# EAGLE design 00A-004 (EAGLE 9.6.2)
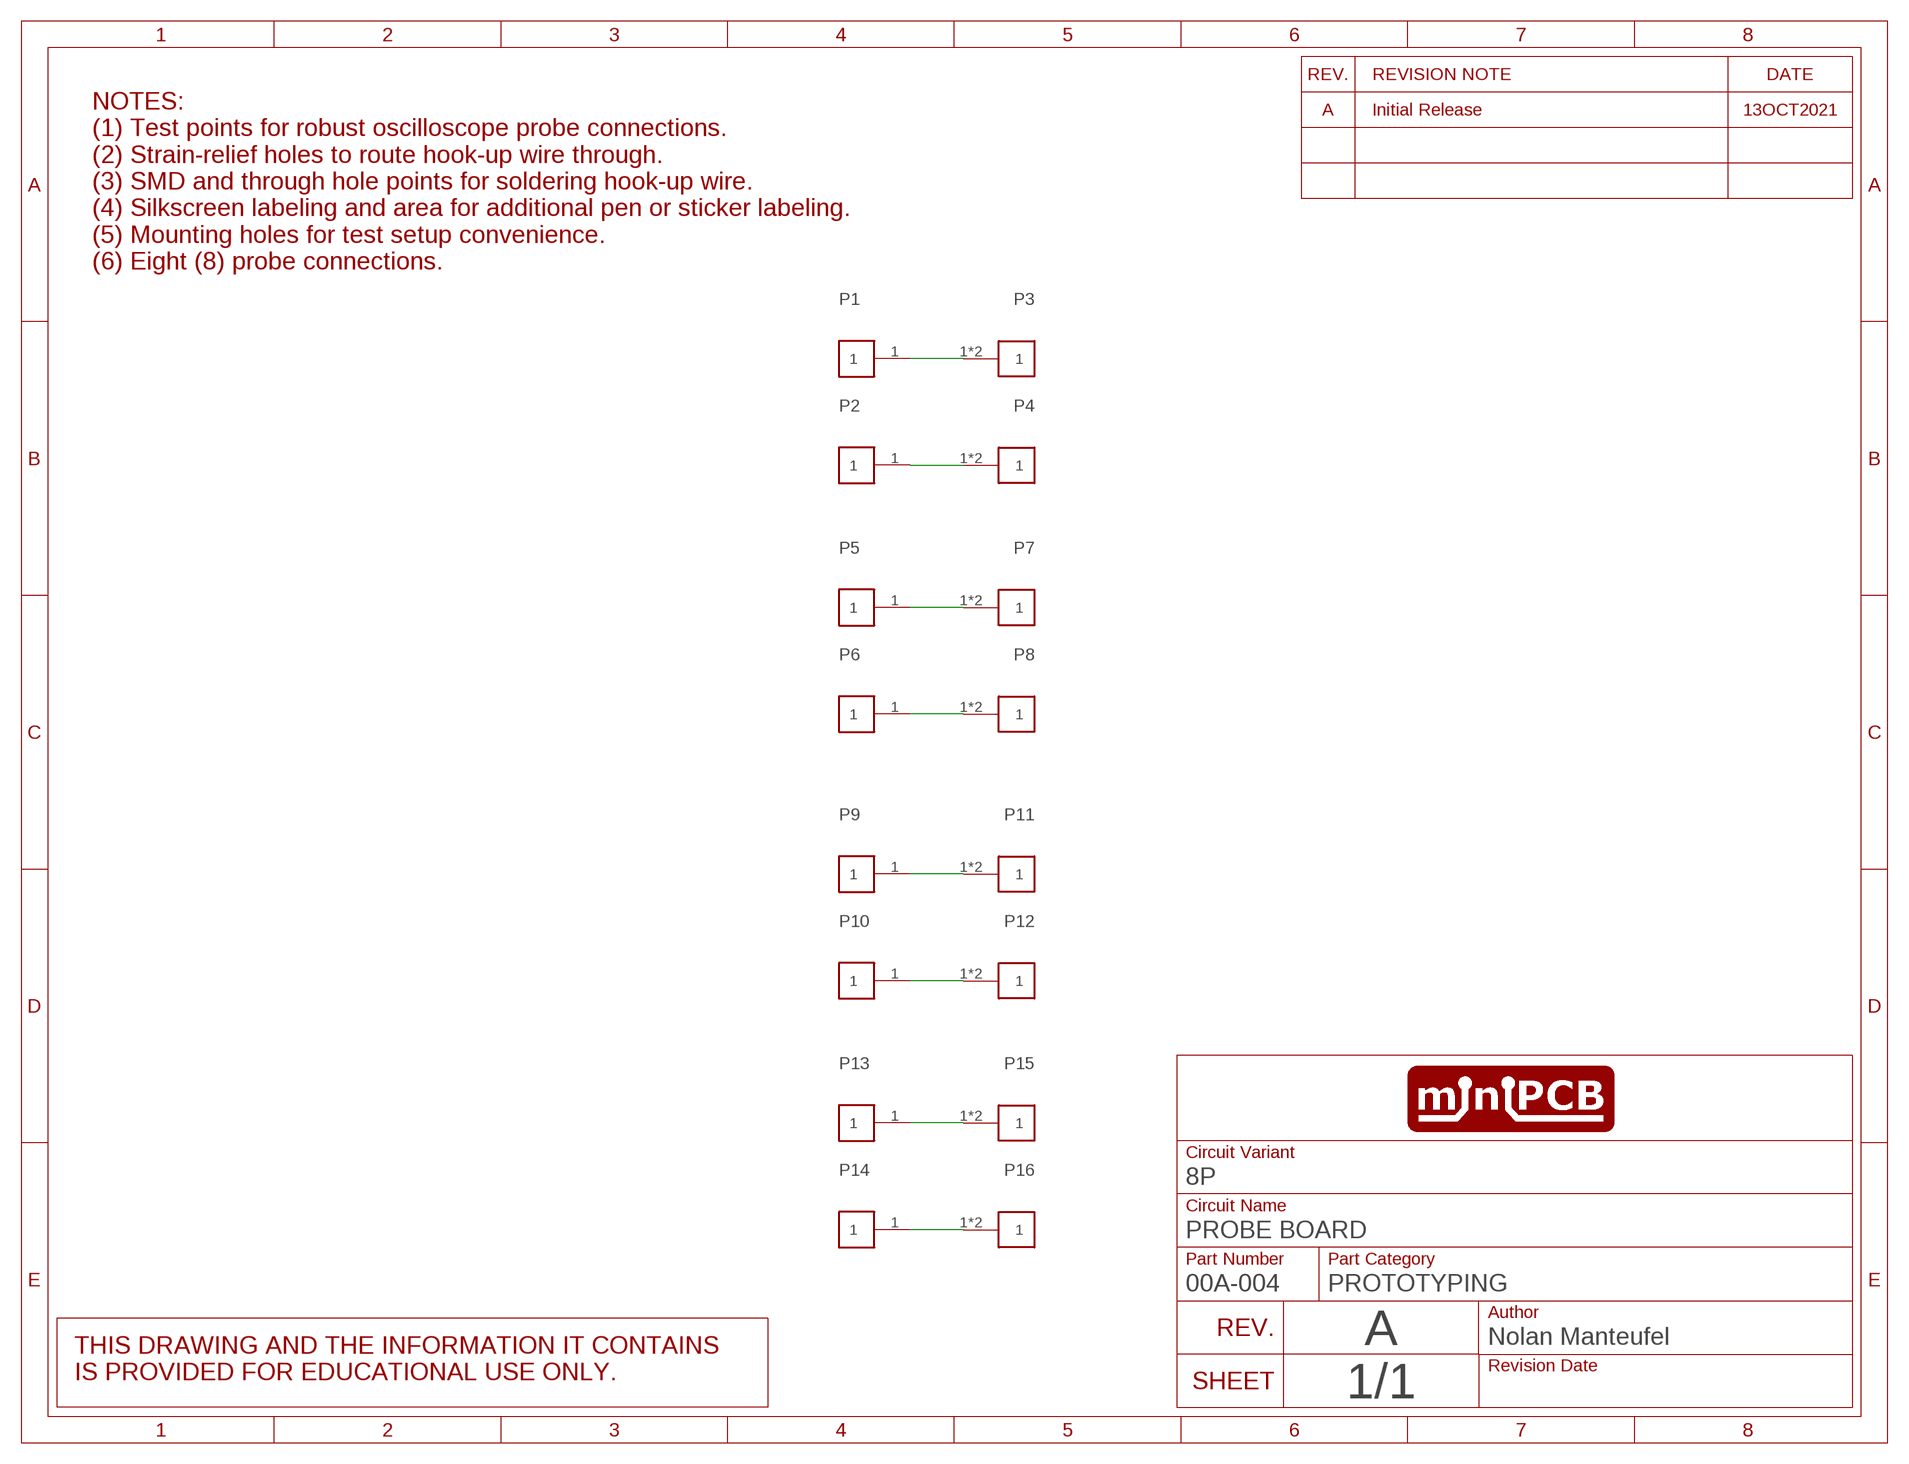
[diagram p0: schematic, sheet 1]
SHEET1 (SCHEMATIC): CIRCUIT_CATEGORY: PROTOTYPING; CIRCUIT_NAME: PROBE BOARD; REVISION: A

## Parts
P1  PINS_1KE_5000  [PINS_1_TESTPOINT_KE5000]
P2  PINS_1KE_5000  [PINS_1_TESTPOINT_KE5000]
P3  PINS_124AWG  [PINS_1_1MM]
P4  PINS_124AWG  [PINS_1_1MM]
P5  PINS_1KE_5000  [PINS_1_TESTPOINT_KE5000]
P6  PINS_1KE_5000  [PINS_1_TESTPOINT_KE5000]
P7  PINS_124AWG  [PINS_1_1MM]
P8  PINS_124AWG  [PINS_1_1MM]
P9  PINS_1KE_5000  [PINS_1_TESTPOINT_KE5000]
P10  PINS_1KE_5000  [PINS_1_TESTPOINT_KE5000]
P11  PINS_124AWG  [PINS_1_1MM]
P12  PINS_124AWG  [PINS_1_1MM]
P13  PINS_1KE_5000  [PINS_1_TESTPOINT_KE5000]
P14  PINS_1KE_5000  [PINS_1_TESTPOINT_KE5000]
P15  PINS_124AWG  [PINS_1_1MM]
P16  PINS_124AWG  [PINS_1_1MM]

## Nets
N$1: P1.1 P3.1 P3.2
N$2: P2.1 P4.1 P4.2
N$3: P5.1 P7.1 P7.2
N$4: P6.1 P8.1 P8.2
N$5: P9.1 P11.1 P11.2
N$6: P10.1 P12.1 P12.2
N$7: P13.1 P15.1 P15.2
N$8: P14.1 P16.1 P16.2

## Notes on the sheet
- NOTES:
  (1) Test points for robust oscilloscope probe connections.
  (2) Strain-relief holes to route hook-up wire through.
  (3) SMD and through hole points for soldering hook-up wire.
  (4) Silkscreen labeling and area for additional pen or sticker labeling.
  (5) Mounting holes for test setup convenience.
  (6) Eight (8) probe connections.
- 13OCT2021

## Library data of the parts
P1-P16 = nolan-utsa:PINS_1

## Board
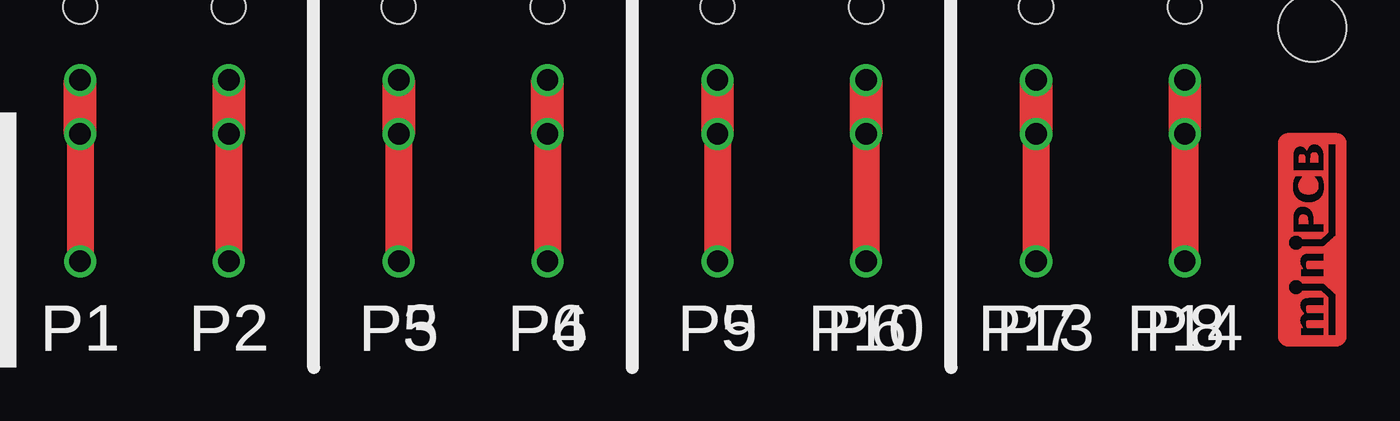
[diagram p1: board, top side]
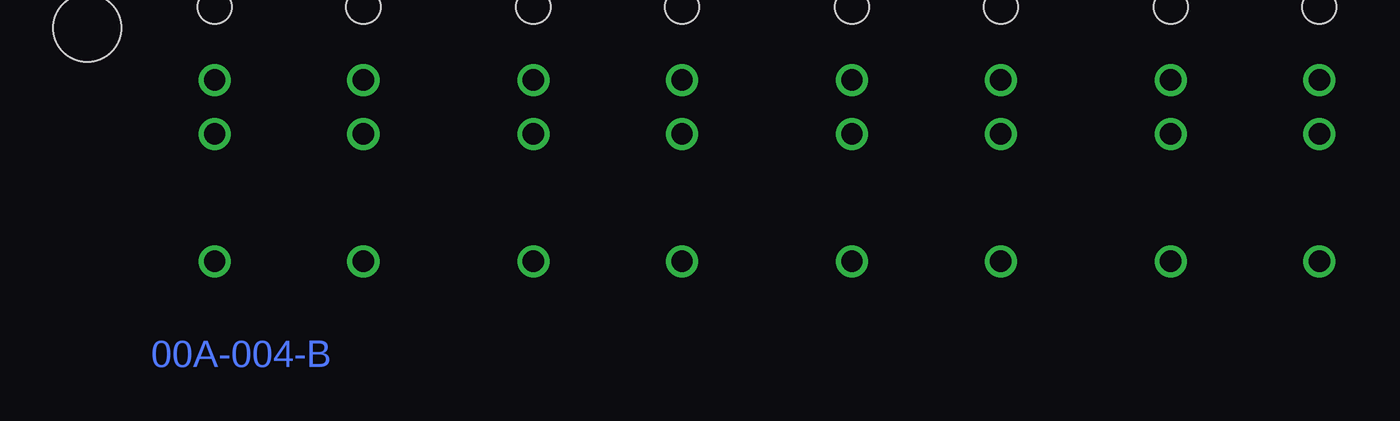
[diagram p2: board, bottom side, seen from below]

No outline drawn. Coordinates in mm, seen from the top.
Copper layers (1*16): Top 0.035mm / dielectric 1.5mm / Bottom 0.035mm
Design rules "default": minimum track width 10mil, minimum drill 24mil, track to track 8mil, track to pad 8mil, pad to pad 8mil, via to via 8mil, smd to smd 8mil, copper to edge 40mil, drill to drill 8mil, minimum pad ring 10mil, minimum via ring 8mil, stop-mask expansion 4mil, vias tented up to drill 0mil, thermal gap 10mil
Holes 1.6 mm at 9,18 16,18 24,18 31,18 39,18 46,18 54,18 61,18
Holes 3.2 mm at 3,17 67,17

### Footprints (pad centres in the part's own frame; a part is rotated, then mirrored left to right if it is on the bottom)
PINS_1_TESTPOINT_KE5000 = drill 1: 1 0,0
PINS_1_1MM = drill 1: 1 0,0; 2 2.54,0

### Placement (x,y rotation side)
P1  9,6 180 top
P2  16,6 180 top
P3  9,12 90 top
P4  16,12 90 top
P5  24,6 180 top
P6  31,6 180 top
P7  24,12 90 top
P8  31,12 90 top
P9  39,6 180 top
P10  46,6 180 top
P11  39,12 90 top
P12  46,12 90 top
P13  54,6 180 top
P14  61,6 180 top
P15  54,12 90 top
P16  61,12 90 top
U$1  [MINIPCB-LOGO]  67,7 90 top

### Tracks (layer width: path | path; a pad name or v marks a point on that pad's centre or on a via)
N$1
  Top 1.27: P3.2 P3.1 P1.1
N$2
  Top 1.27: P4.2 P4.1 P2.1
N$3
  Top 1.27: P7.2 P7.1 P5.1
N$4
  Top 1.27: P8.2 P8.1 P6.1
N$5
  Top 1.27: P11.2 P11.1 P9.1
N$6
  Top 1.27: P12.2 P12.1 P10.1
N$7
  Top 1.27: P15.2 P15.1 P13.1
N$8
  Top 1.27: P16.2 P16.1 P14.1

### Text on the board
Bottom: 00A-004-B
_tPlace: P1 | P2 | P3 | P4 | P5 | P6 | P7 | P8